# EAGLE design lnk304 (EAGLE 7.3.0)
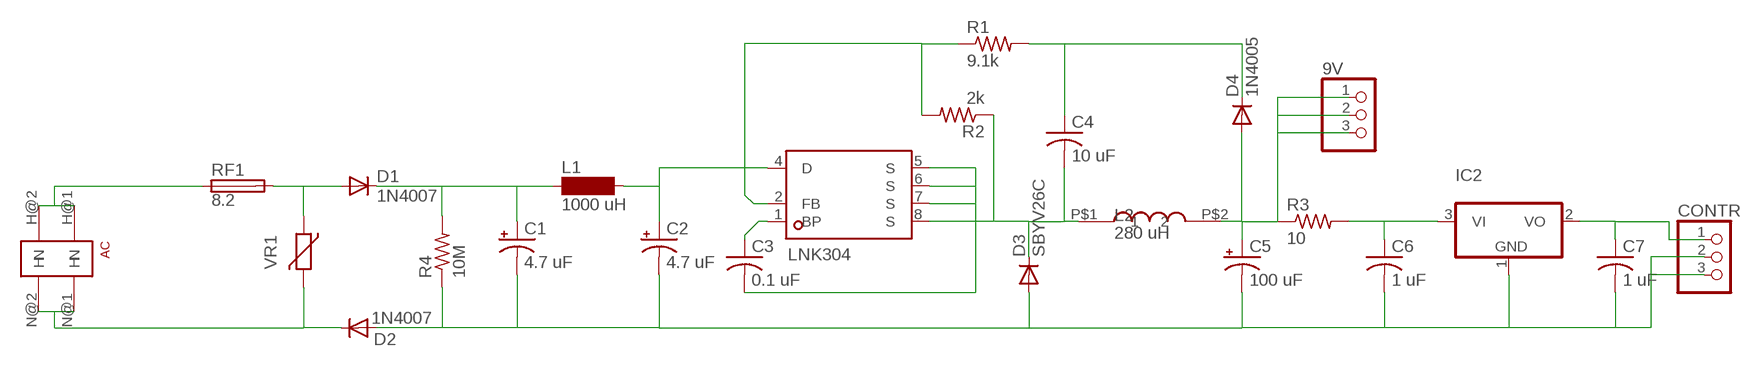
[diagram p0: schematic, sheet 1]

## Parts
9V  PINHD-1X3  [1X03]
AC  TBLOCK02X2  [TBLOCK02X2]
C1  4.7 uF  CPOL-USE5-10.5  [E5-10,5]
C2  4.7 uF  CPOL-USE5-10.5  [E5-10,5]
C3  0.1 uF  C-USC0603  [C0603]
C4  10 uF  C-USC0603  [C0603]
C5  100 uF  CPOL-USE2-4  [E2-4]
C6  1 uF  C-USC0603  [C0603]
C7  1 uF  C-USC0603  [C0603]
CONTR  PINHD-1X3  [1X03]
D1  1N4007  1N4004  [DO41-10]
D2  1N4007  1N4004  [DO41-10]
D3  SBYV26C  1N4004  [DO41-10]
D4  1N4005  1N4004  [DO41-10]
IC2  MCP1703CB  [SOT23]
L1  1000 uH  BS11  [BS11]
L2  280 uH  ELL-6UH681M  [ELL-6UH681M]
LNK304  LNK30X  [SO08C]
R1  9.1k  R-US_R0603  [R0603]
R2  2k  R-US_R0603  [R0603]
R3  10  R-US_R1206  [R1206]
R4  10M  R-US_R1206  [R1206]
RF1  8.2  FUSEPICOFUSE  [PICOFUSE]
VR1  VARISTOR-7,5  [R-7,5]

## Nets
GND: C1.- C2.- C5.- C6.2 C7.2 CONTR.2 CONTR.3 D2.A D3.A IC2.1(GND) R4.1
N$1: D1.A RF1.2 VR1.1
N$2: C1.+ D1.C L1.1 R4.2
N$3: C2.+ L1.2 LNK304.4(D)
N$4: 9V.1 9V.2 9V.3 C5.+ D4.A L2.P$2 R3.1
N$5: LNK304.2(FB) R1.1 R2.2
N$6: AC.N@1(N) AC.N@2(N) D2.C VR1.2
N$7: C3.1 LNK304.1(BP)
N$8: C3.2 C4.2 D3.C L2.P$1 LNK304.5(S) LNK304.6(S) LNK304.7(S) LNK304.8(S) R2.1
N$10: C4.1 D4.C R1.2
N$11: C6.1 IC2.3(VI) R3.2
N$12: AC.H@1(H) AC.H@2(H) RF1.1
N$14: C7.1 CONTR.1 IC2.2(VO)

## Library data of the parts
9V CONTR = adafruit:PINHD-1X3: PIN HEADER
AC = userdefined:TBLOCK02X2
C1 C2 C5 = adafruit:CPOL-US: POLARIZED CAPACITOR, American symbol
C3 C4 C6 C7 = adafruit:C-US: CAPACITOR, American symbol
D1-D4 = adafruit:1N4004: DIODE General purpose 1N400x type rectifier (With bigger pads) http://www.ladyada.net/library/pcb/eaglelibrary.html
IC2 = linear:MCP1703: 250 mA, 16V, Low Quiescent Current LDO Regulator Source: http://ww1.microchip.com/downloads/en/DeviceDoc/22049b.pdf
L1 = inductor-neosid:BS: INDUCTOR nominal inductance, magnetically screened; OC_FARNELL: unknown; OC_NEWARK: unknown
L2 = userdefined:ELL-6UH681M
LNK304 = userdefined:LNK30X
R1-R3 = adafruit:R-US_: RESISTOR, American symbol
R4 = resistor:R-US_: RESISTOR, American symbol
RF1 = fuse:FUSE: Fuse; OC_FARNELL: unknown; OC_NEWARK: unknown
VR1 = varistor:VARISTOR: VARISTOR

## Board
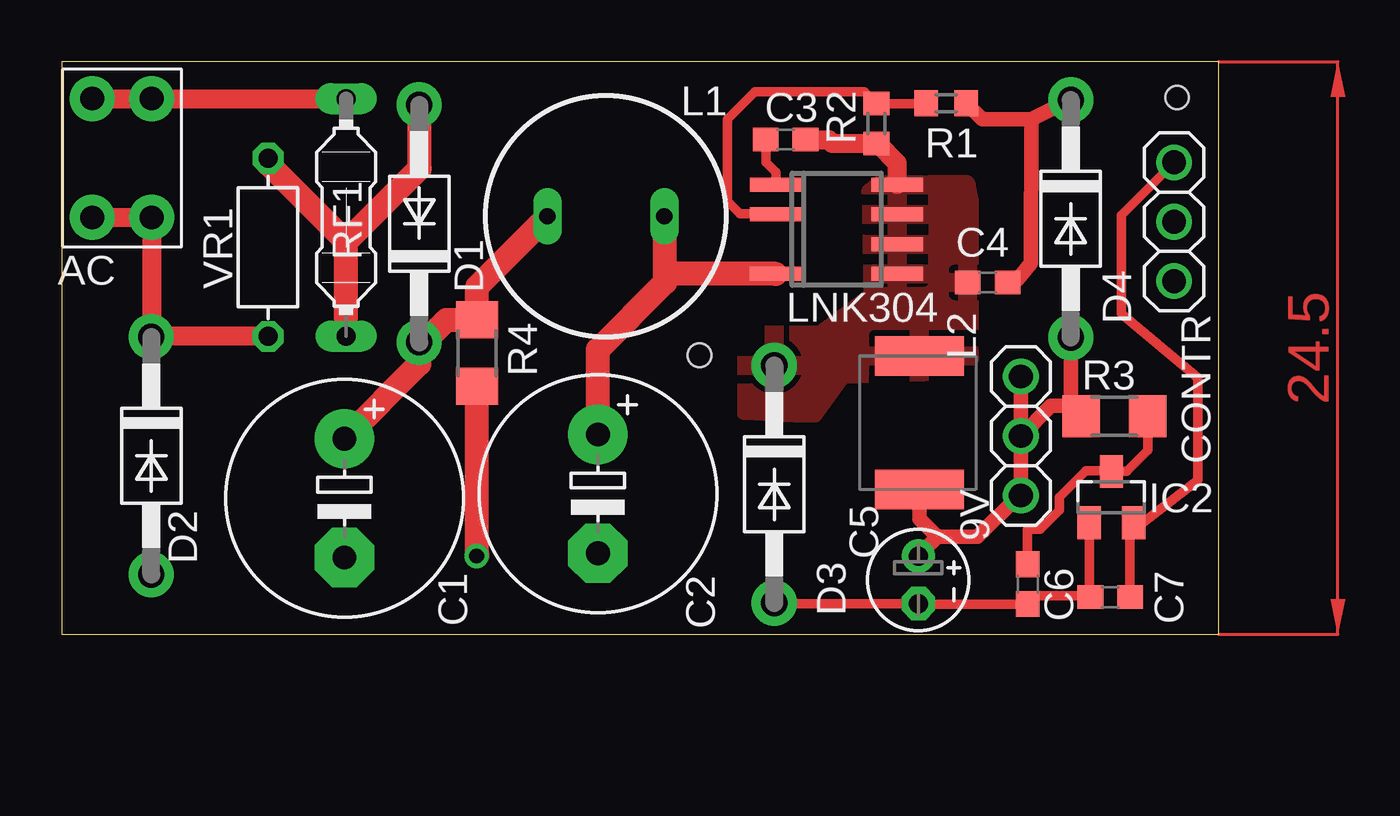
[diagram p1: board, top side]
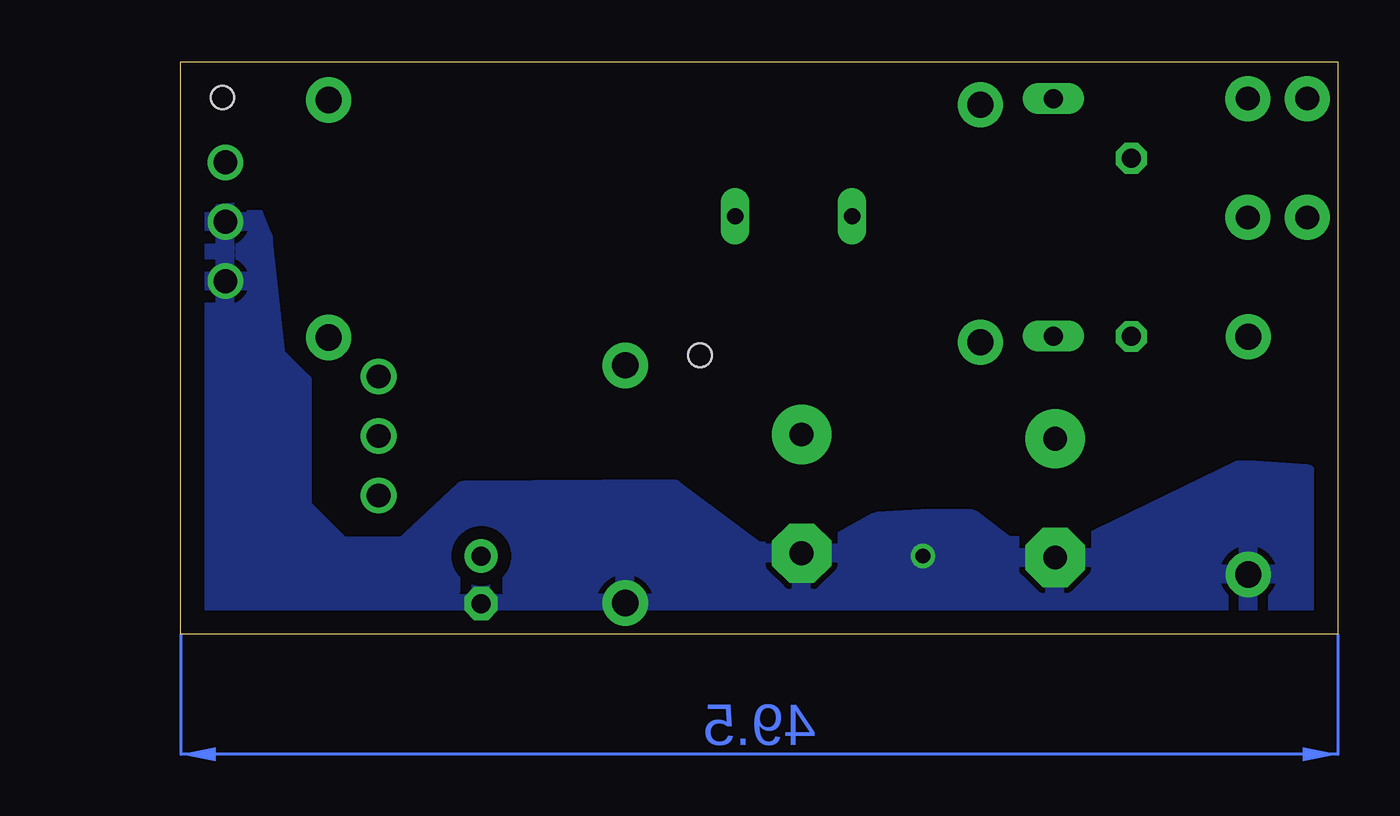
[diagram p2: board, bottom side, seen from below]

Size 49.5 x 24.5 mm. Coordinates in mm from the lower left corner, seen from the top.
Outline: 0,0 49.5,0 49.5,24.5 0,24.5 0,0
Copper layers (1*16): Top 0.035mm / dielectric 1.5mm / Bottom 0.035mm
Design rules "default": minimum track width 10mil, minimum drill 24mil, track to track 8mil, track to pad 8mil, pad to pad 8mil, via to via 8mil, smd to smd 8mil, copper to edge 40mil, drill to drill 8mil, minimum pad ring 10mil, minimum via ring 8mil, stop-mask expansion 4mil, vias tented up to drill 0mil, thermal gap 10mil
Holes 1 mm at 27.3,11.94 47.72,22.96

### Footprints (pad centres in the part's own frame; a part is rotated, then mirrored left to right if it is on the bottom)
1X03 = drill 1.016: 1 -2.54,0; 2 0,0; 3 2.54,0
TBLOCK02X2 = drill 1.016 pad 1.93: H@1 -1.27,2.54; H@2 1.27,2.54; N@1 -1.27,-2.54; N@2 1.27,-2.54
E5-10,5 = drill 1.016 pad 2.54: + -2.54,0 | drill 1.016 pad 2.54 octagon: - 2.54,0
C0603 = smd 1.1 x 1: 1 -0.85,0; 2 0.85,0
E2-4 = drill 0.813 pad 1.422: + -1.016,0 | drill 0.813 pad 1.422 octagon: - 1.016,0
DO41-10 = drill 1.118 pad 1.93: A 5.08,0; C -5.08,0
SOT23 = smd 1 x 1.4: 1 -0.95,-1.1; 2 0.95,-1.1; 3 0,1.1
BS11 = drill 0.7 long: 1 -2.5,0; 2 2.5,0
ELL-6UH681M = smd 1.7 x 3.81: P$1 -2.921,0; P$2 2.794,0
SO08C = smd 0.6 x 2.2: 1 -1.905,-2.6; 2 -0.635,-2.6; 4 1.905,-2.6; 5 1.905,2.6; 6 0.635,2.6; 7 -0.635,2.6; 8 -1.905,2.6
R0603 = smd 1 x 1.1: 1 -0.85,0; 2 0.85,0
R1206 = smd 1.6 x 1.803: 1 -1.422,0; 2 1.422,0
PICOFUSE = drill 0.813 long: 1 -5.08,0; 2 5.08,0
R-7,5 = drill 0.813 octagon: 1 -3.81,0; 2 3.81,0

### Placement (x,y rotation side)
9V  41.04,8.49 90 top
AC  2.59,20.37 0 top
C1  12.11,5.83 270 top
C2  22.95,6.01 270 top
C3  30.97,21.16 0 top
C4  39.62,15.06 180 top
C5  36.65,2.34 270 top
C6  41.32,2.15 270 top
C7  44.86,1.6 180 top
CONTR  47.59,17.65 270 top
D1  15.3,17.57 90 top
D2  3.84,7.65 270 top
D3  30.49,6.42 270 top
D4  43.17,17.78 270 top
IC2  44.91,5.87 0 top
L1  23.29,17.88 0 top
L2  36.69,8.99 270 top
LNK304  33.16,17.33 270 top
R1  37.85,22.72 0 top
R2  34.86,21.85 90 top
R3  45.04,9.32 0 top
R4  17.78,12.03 90 top
RF1  12.18,17.84 270 top
VR1  8.83,16.55 270 top

### Tracks (layer width: path | path; a pad name or v marks a point on that pad's centre or on a via)
GND  (via drill 0.64 pad 1.02)
  Top 0.406: IC2.1 43.96,1.65 | 43.96,1.65 C7.2 | 43.96,1.65 41.67,1.65 C6.2 36.68,1.3 C5.- 30.51,1.32 D3.A
  Top 0.61: 17.78,3.38 v17.76,3.36
  Top 1.016: 17.78,3.38 R4.1
  pour Bottom (isolate 0.559): 1.33,6.86 4.18,7.07 10.91,3.8 14.17,3.8 15.67,4.94 17.83,4.94 19.7,4.84 22.16,3.46 24.36,3.46 24.46,3.56 24.85,3.56 28.44,6.23 37.41,6.16 39.96,3.76 42.62,3.76 44.29,5.43 44.29,10.79 45.42,11.93 45.97,16.95 46.44,18.14 48.96,17.89 49.02,16.72 49.18,0.67 48.88,0.37 1.2,0.37 0.53,1.03 0.53,6.08 1.3,6.85
N$1
  Top 1.016: RF1.2 12.18,16.79 | 12.18,16.79 15.32,19.93 15.32,22.63 D1.A | VR1.1 8.84,20.13 12.18,16.79
N$2
  Top 1.016: C1.+ 15.3,11.57 D1.C 15.5,12.49 16.47,13.45 R4.2 17.78,14.88 L1.1
N$3
  Top 1.016: C2.+ 22.95,12.18 25.82,15.05 25.82,15.39 | 25.82,15.39 25.82,17.85 L1.2 | LNK304.4 25.85,15.42 25.82,15.39
N$4
  Top 0.406: 43.56,9.27 R3.1 43.17,9.77
  Top 0.61: 36.72,3.42 C5.+ 37.47,4.17 | 9V.3 9V.2 | 9V.1 9V.2 | D4.A 43.17,9.77 42.32,9.77 9V.2 | 9V.2 41.04,6.02 39.18,4.17 37.47,4.17 | L2.P$2 36.69,4.94 37.47,4.17
N$5
  Top 0.406: 36.95,22.67 R1.1 36.98,22.7 R2.2 34.36,23.2 29.68,23.2 28.49,22.02 28.49,18.52 29.03,17.98 30.54,17.98 LNK304.2
N$6
  Top 0.813: VR1.2 3.86,12.74 D2.C 3.86,12.74 AC.N@2 AC.N@1
N$7
  Top 0.406: LNK304.1 30.55,19.77 30.13,20.2 C3.1
N$8
  Top 0.813: C3.2 32.82,21.16 32.98,21 R2.1 34.9,21 35.74,20.16 35.74,19.24 LNK304.8
  pour Top: 29.23,9.58 32.17,9.44 33.38,11.13 38.31,11.27 38.84,11.82 38.84,18.52 38.69,19.23 35.03,19.22 34.62,18.91 34.71,14.47 32.46,12.78 30.08,12.78 29.29,12 29.29,9.65
N$10
  Top 0.406: 40.89,15.17 40.46,15.17 40.47,15.16 C4.1
  Top 0.61: D4.C 41.48,22.03 | 41.48,22.03 41.46,15.88 40.89,15.17 | 41.48,22.03 39.39,22.03 R1.2
N$11
  Top 0.406: R3.2 46.48,9.31 46.48,7.89 45.57,6.97 IC2.3 44.89,6.99 43.82,6.99 42.69,5.86 42.69,5.32 41.86,4.5 41.32,4.5 C6.1
N$12
  Top 0.813: AC.H@1 AC.H@2 RF1.1
N$14
  Top 0.406: C7.1 45.71,4.62 IC2.2 46.25,4.77 48.61,6.6 48.61,10.97 45.34,13.71 45.34,17.93 CONTR.1
(copper drawn outside any net)
  shapes: Bottom area x1, Top area x1